# Altium schematic sheet INTERNAL_REGULATORS.SchDoc
size C; SheetNumber: 5; SheetTotal: 5
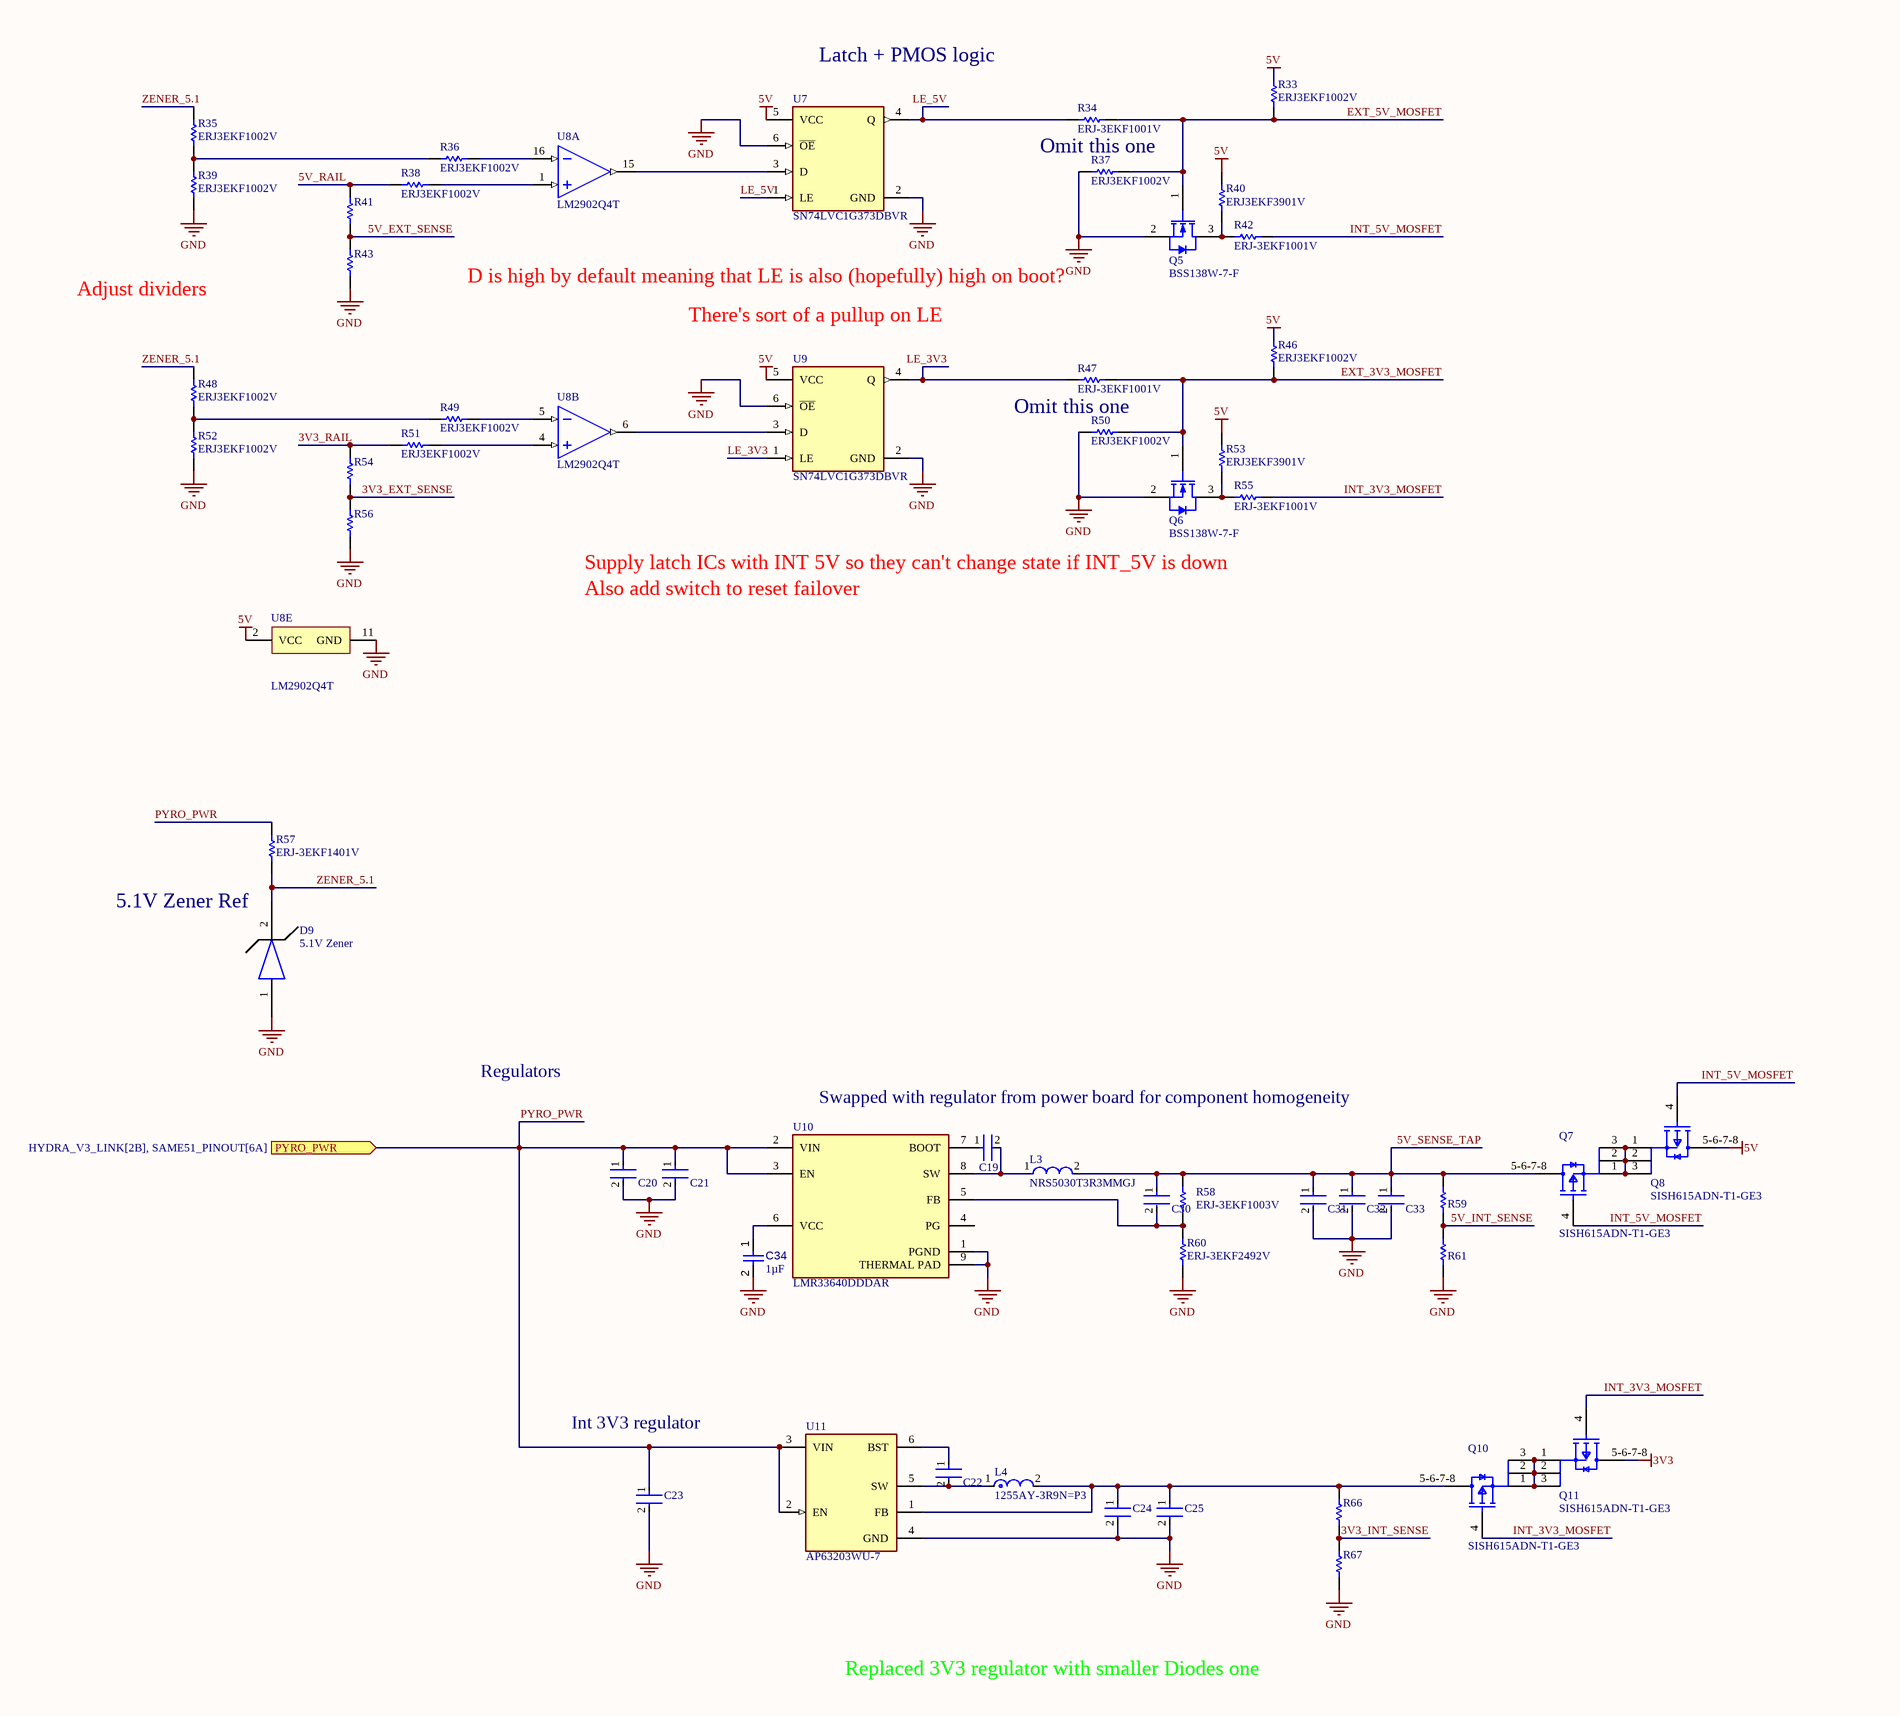
[diagram p0: INTERNAL_REGULATORS.SchDoc, left]
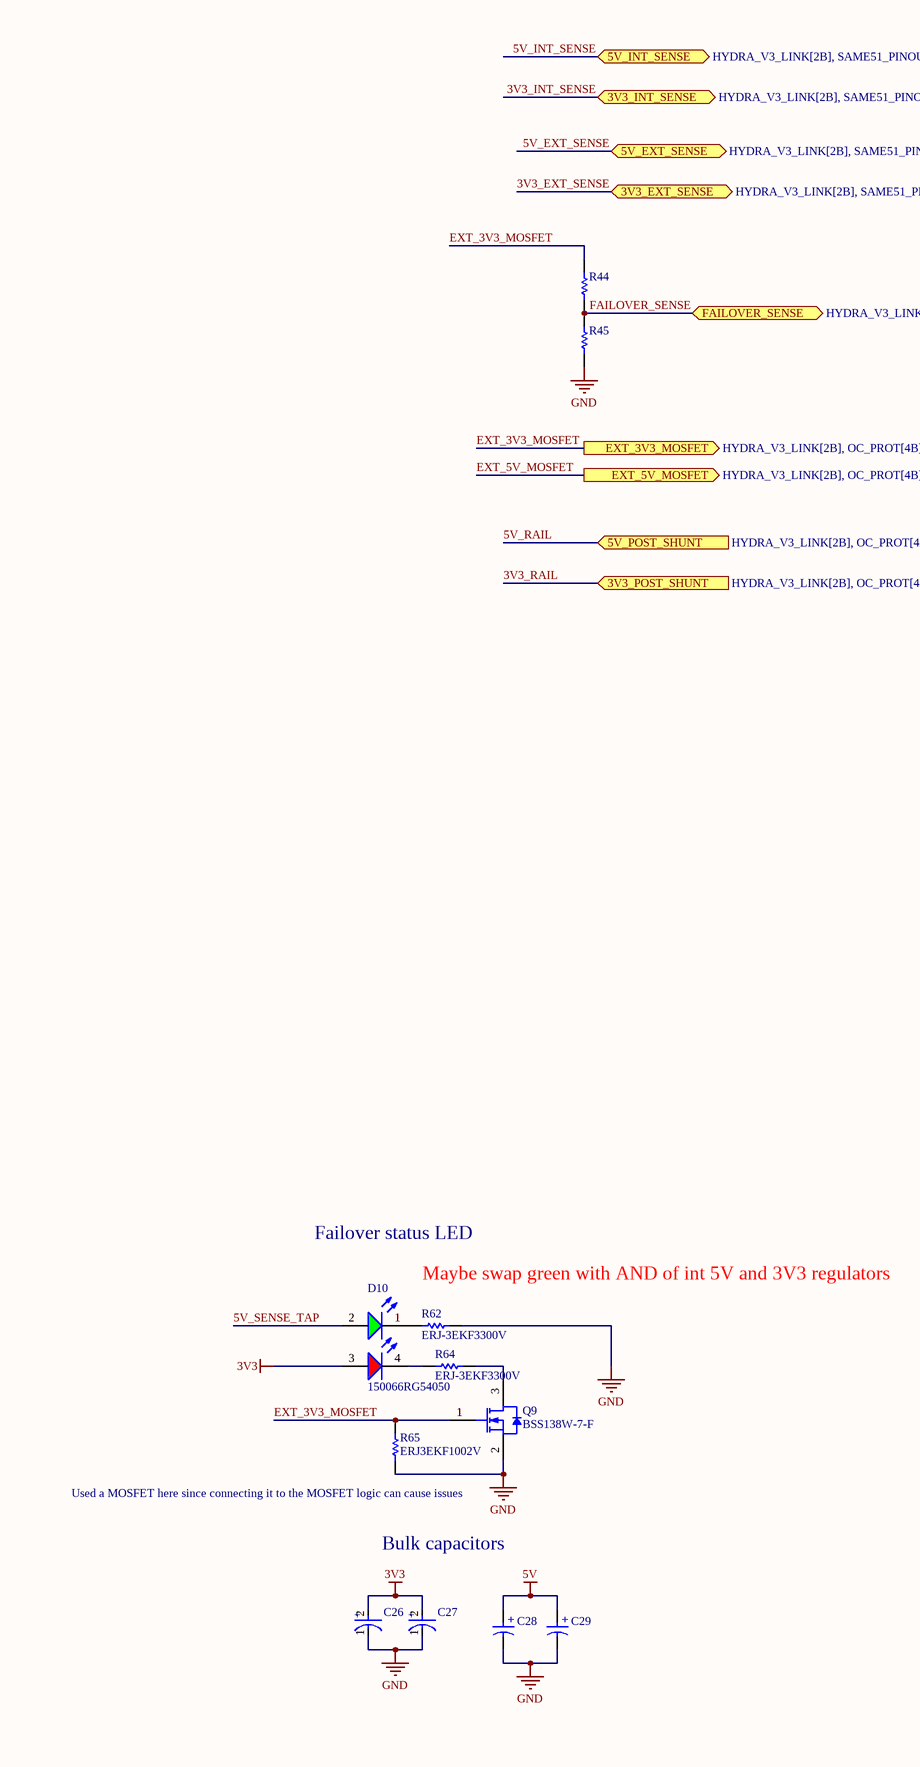
[diagram p1: INTERNAL_REGULATORS.SchDoc, right]

## Parts
C19  C0402C104K8PACTU  [FP-C0402-BB-MFG]  (value not drawn)
C20  CL10A106MA8NRNC  [FP-CL10-IPC_B]  (value not drawn)
C21  C0603C224M3RACTU  [FP-C0603C-CF-IPC_B]  (value not drawn)
C22  C0402C104K8PACTU  [FP-C0402-BB-MFG]  (value not drawn)
C23  C0805C106K8PACTU  [FP-C0805C-DG-MFG]  (value not drawn)
C24  GRM21BR61E226ME44L  [FP-GRM21B-0_2-e0_2_0_7-IPC_B]  (value not drawn)
C25  GRM21BR61E226ME44L  [FP-GRM21B-0_2-e0_2_0_7-IPC_B]  (value not drawn)
C26  6TPE120MAZB  [FP-POSCAP-B2-MFG]  (value not drawn)
C27  6TPE120MAZB  [FP-POSCAP-B2-MFG]  (value not drawn)
C28  875035119002  [WCAP-PHLE_L7.3W4.3H1.9]  (value not drawn)
C29  875035119002  [WCAP-PHLE_L7.3W4.3H1.9]  (value not drawn)
C30  C0603C101M3RACAUTO  [FP-C0603C-CF-IPC_B]  (value not drawn)
C31  CL10A226MO7JZNC  [FP-CL10-IPC_B]  (value not drawn)
C32  CL10A226MO7JZNC  [FP-CL10-IPC_B]  (value not drawn)
C33  CL10A226MO7JZNC  [FP-CL10-IPC_B]  (value not drawn)
C34  value 1µF  [CAPC1608X90X35ML15T15]  (hidden comment: Capacitor 1uF +/- 10% 16V 0603)
D9  5.1V Zener  [BZX884B5V1L-HG3-08-Footprint-1]
D10  150066RG54050  [WL-SBCD_0606]
L3  NRS5030T3R3MMGJ  [FP-NRS5030-H_3_1-MFG]
L4  1255AY-3R9N=P3  [FP-DG6045C-MFG]
Q5  BSS138W-7-F  [DIOD-SOT323-3_V]
Q6  BSS138W-7-F  [DIOD-SOT323-3_V]
Q7  SISH615ADN-T1-GE3  [SISH615ADN-T1-GE3-Footprint-1]
Q8  SISH615ADN-T1-GE3  [SISH615ADN-T1-GE3-Footprint-1]
Q9  BSS138W-7-F  [DIOD-SOT323-3_V]
Q10  SISH615ADN-T1-GE3  [SISH615ADN-T1-GE3-Footprint-1]
Q11  SISH615ADN-T1-GE3  [SISH615ADN-T1-GE3-Footprint-1]
R33  ERJ3EKF1002V  [RESC1609X55X30LL15T15]
R34  ERJ-3EKF1001V  [RESC1608X55X30LL15T15]
R35  ERJ3EKF1002V  [RESC1609X55X30LL15T15]
R36  ERJ3EKF1002V  [RESC1609X55X30LL15T15]
R37  ERJ3EKF1002V  [RESC1609X55X30LL15T15]
R38  ERJ3EKF1002V  [RESC1609X55X30LL15T15]
R39  ERJ3EKF1002V  [RESC1609X55X30LL15T15]
R40  ERJ3EKF3901V  [RESC1608X55X30ML15T15]
R41  ERJ3EKF1002V  [RESC1609X55X30LL15T15]  (value not drawn)
R42  ERJ-3EKF1001V  [RESC1608X55X30LL15T15]
R43  ERJ3EKF1002V  [RESC1609X55X30LL15T15]  (value not drawn)
R44  ERJ3EKF1002V  [RESC1609X55X30LL15T15]  (value not drawn)
R45  ERJ3EKF1002V  [RESC1609X55X30LL15T15]  (value not drawn)
R46  ERJ3EKF1002V  [RESC1609X55X30LL15T15]
R47  ERJ-3EKF1001V  [RESC1608X55X30LL15T15]
R48  ERJ3EKF1002V  [RESC1609X55X30LL15T15]
R49  ERJ3EKF1002V  [RESC1609X55X30LL15T15]
R50  ERJ3EKF1002V  [RESC1609X55X30LL15T15]
R51  ERJ3EKF1002V  [RESC1609X55X30LL15T15]
R52  ERJ3EKF1002V  [RESC1609X55X30LL15T15]
R53  ERJ3EKF3901V  [RESC1608X55X30ML15T15]
R54  ERJ3EKF1002V  [RESC1609X55X30LL15T15]  (value not drawn)
R55  ERJ-3EKF1001V  [RESC1608X55X30LL15T15]
R56  ERJ3EKF1002V  [RESC1609X55X30LL15T15]  (value not drawn)
R57  ERJ-3EKF1401V  [RESC1608X55X30NL15T15]
R58  ERJ-3EKF1003V  [RESC1608X55X30LL15T15]
R59  ERJ3EKF1002V  [RESC1609X55X30LL15T15]  (value not drawn)
R60  ERJ-3EKF2492V  [RESC1608X55X30LL15T15]
R61  ERJ3EKF1002V  [RESC1609X55X30LL15T15]  (value not drawn)
R62  ERJ-3EKF3300V  [RESC1608X55X30LL15T15]
R64  ERJ-3EKF3300V  [RESC1608X55X30LL15T15]
R65  ERJ3EKF1002V  [RESC1609X55X30LL15T15]
R66  ERJ3EKF1002V  [RESC1609X55X30LL15T15]  (value not drawn)
R67  ERJ3EKF1002V  [RESC1609X55X30LL15T15]  (value not drawn)
U7  SN74LVC1G373DBVR  [FP-DBV0006A-MFG]
U8  LM2902Q4T  [LM2902Q4T-Footprint-1]  (parts A,B,E of 5)
U9  SN74LVC1G373DBVR  [FP-DBV0006A-MFG]
U10  LMR33640DDDAR  [FP-DDA0008J-IPC_A]
U11  AP63203WU-7  [FP-TSOT26-MFG]

## Ports
3V3_EXT_SENSE (bidir, see HYDRA_V3_LINK[2B], SAME51_PINOUT[6B]), 3V3_INT_SENSE (bidir, see HYDRA_V3_LINK[2B], SAME51_PINOUT[6B]), 3V3_POST_SHUNT (in, see HYDRA_V3_LINK[2B], OC_PROT[4A]), 5V_EXT_SENSE (bidir, see HYDRA_V3_LINK[2B], SAME51_PINOUT[6B]), 5V_INT_SENSE (bidir, see HYDRA_V3_LINK[2B], SAME51_PINOUT[6A]), 5V_POST_SHUNT (in, see HYDRA_V3_LINK[2B], OC_PROT[4A]), EXT_3V3_MOSFET (out, see HYDRA_V3_LINK[2B], OC_PROT[4B]), EXT_5V_MOSFET (out, see HYDRA_V3_LINK[2B], OC_PROT[4B]), FAILOVER_SENSE (bidir, see HYDRA_V3_LINK[2B], SAME51_PINOUT[6B]), PYRO_PWR (in, see HYDRA_V3_LINK[2B], SAME51_PINOUT[6A])

## Nets
3V3: C26.2(A) C27.2(A) D10.3(A) Q11.5-6-7-8(D)
5V: C28.1(P) C29.1(P) Q8.5-6-7-8(D) R33.1 R40.2 R46.1 R53.2 U7.5(VCC) U8.2(VCC) U9.5(VCC)
GND: C20.2 C21.2 C23.2 C24.2 C25.2 C26.1(C) C27.1(C) C28.2(N) C29.2(N) C31.2 C32.2 C33.2 C34.2 D9.1 Q5.2(S) Q6.2(S) Q9.2(S) R37.2 R39.2 R43.1 R45.1 R50.2 R52.2 R56.1 R60.1 R61.1 R62.2 R65.1 R67.1 U7.2(GND) U7.6(~{OE}) U8.11(GND) U9.2(GND) U9.6(~{OE}) U10.1(PGND) U10.9(THERMAL_PAD) U11.4(GND)
3V3_EXT_SENSE: R54.1 R56.2 ; port 3V3_EXT_SENSE
3V3_INT_SENSE: R66.1 R67.2 ; port 3V3_INT_SENSE
3V3_RAIL: R51.2 R54.2 ; port 3V3_POST_SHUNT
5V_EXT_SENSE: R41.1 R43.2 ; port 5V_EXT_SENSE
5V_INT_SENSE: R59.1 R61.2 ; port 5V_INT_SENSE
5V_RAIL: R38.2 R41.2 ; port 5V_POST_SHUNT
5V_SENSE_TAP: C30.1 C31.1 C32.1 C33.1 D10.2(A) L3.2 Q7.5-6-7-8(D) R58.2 R59.2
EXT_3V3_MOSFET: Q6.1(G) Q9.1(G) R44.2 R46.2 R47.1 R50.1 R65.2 ; port EXT_3V3_MOSFET
EXT_5V_MOSFET: Q5.1(G) R33.2 R34.1 R37.1 ; port EXT_5V_MOSFET
FAILOVER_SENSE: R44.1 R45.2 ; port FAILOVER_SENSE
INT_3V3_MOSFET: Q10.4(G) Q11.4(G) R55.2
INT_5V_MOSFET: Q7.4(G) Q8.4(G) R42.2
LE_3V3: R47.2 U9.1(LE) U9.4(Q)
LE_5V: R34.2 U7.1(LE) U7.4(Q)
PYRO_PWR: C20.1 C21.1 C23.1 R57.2 U10.2(VIN) U10.3(EN) U11.2(EN) U11.3(VIN) ; port PYRO_PWR
ZENER_5.1: D9.2 R35.1 R48.1 R57.1
NetC19_1: C19.1 U10.7(BOOT)
NetC19_2: C19.2 L3.1 U10.8(SW)
NetC22_1: C22.1 U11.6(BST)
NetC22_2: C22.2 L4.1 U11.5(SW)
NetC24_1: C24.1 C25.1 L4.2 Q10.5-6-7-8(D) R66.2 U11.1(FB)
NetC30_2: C30.2 R58.1 R60.2 U10.5(FB)
NetC34_1: C34.1 U10.6(VCC)
NetD10_1: D10.1(K) R62.1
NetD10_4: D10.4(K) R64.1
NetQ5_3: Q5.3(D) R40.1 R42.1
NetQ6_3: Q6.3(D) R53.1 R55.1
NetQ7_1: Q7.1(S) Q7.2(S) Q7.3(S) Q8.1(S) Q8.2(S) Q8.3(S)
NetQ9_3: Q9.3(D) R64.2
NetQ10_1: Q10.1(S) Q10.2(S) Q10.3(S) Q11.1(S) Q11.2(S) Q11.3(S)
NetR35_2: R35.2 R36.2 R39.1
NetR36_1: R36.1 U8.16(1IN-)
NetR38_1: R38.1 U8.1(1IN+)
NetR48_2: R48.2 R49.2 R52.1
NetR49_1: R49.1 U8.5(2IN-)
NetR51_1: R51.1 U8.4(2IN+)
NetU7_3: U7.3(D) U8.15(1OUT)
NetU8_6: U8.6(2OUT) U9.3(D)

Not connected (* = marked no-connect by the designer): U10 4(PG)

## Notes on the sheet
- Latch + PMOS logic
- Omit this one
- Adjust dividers
- D is high by default meaning that LE is also (hopefully) high on boot?
- There's sort of a pullup on LE
- Supply latch ICs with INT 5V so they can't change state if INT_5V is down
- Also add switch to reset failover
- 5.1V Zener Ref
- Regulators
- Swapped with regulator from power board for component homogeneity
- Failover status LED
- Maybe swap green with AND of int 5V and 3V3 regulators
- Int 3V3 regulator
- (near R65) Used a MOSFET here since connecting it to the MOSFET logic can cause issues
- Bulk capacitors
- Replaced 3V3 regulator with smaller Diodes one
- (in symbol CMP-03913-98099420-1) +
- (in symbol CMP-05428-000212-1) +

## Library data of the parts
C19 C22 = CMP-2008-02046-2: CAP CER 0.1UF 10V X5R 0402; Manufacturer: Kemet; Material: Ceramic; Capacitance: 0.10 μF; Temperature Coefficient: 15%; Tolerance: 0.1; Value: 0.10 μF; Package: C0402-BB; Temperature: -55°C to +125°C; ComponentLink2Description: Datasheet; Temperature Characteristic: X5R; Device Class L1: Passive Components; Height: 0.55mm; Lead Free: Yes; ComponentLink2URL: https://content.kemet.com/datasheets/KEM_C1002_X7R_SMD.pdf; Device Class L2: Capacitors; Temperature Range Low: -55°C; Temperature Range High: +125°C; RoHS: TRUE; Octopart: https://octopart.com/c0402c104k8pactu-kemet-140039; Automotive: No; Mouser Description: Capacitor 100 nF 10 VDC 0402; Category: Cap; Voltage Rating: 10 V; Digikey Description: CAP CER 0.1UF 10V X5R 0402; Ipc Land Pattern Name: CAPC10050X50; Device Class L3: Ceramic Capacitors; Manufacturer Part Number: C0402C104K8PACTU
C20 = CMP-001-00091-1: Ceramic Capacitor, Multilayer, Ceramic, 25V, 20% +Tol, 20% -Tol, X5R, 15% TC, 10uF, Surface Mount, 0603
C21 = CMP-001-00092-1: Ceramic Capacitor, Multilayer, Ceramic, 25V, 20% +Tol, 20% -Tol, X7R, 15% TC, 0.22uF, Surface Mount, 0603
C23 = CMP-2007-03243-2: CAP CER 10UF 10V X5R 0805; Manufacturer: Kemet; 3DS Part Number: 220-00001; Tolerance: 10%; Temperature Coefficient: 15%; Material: Ceramic; Device Class L2: Capacitors; Device Class L1: Passive Components; ComponentLink2URL: https://content.kemet.com/datasheets/KEM_C1006_X5R_SMD.pdf; Height: 1.4mm; Lead Free: Yes; Manufacturer Part Number: C0805C106K8PACTU; Digikey Description: CAP CER 10UF 10V X5R 0805; Octopart: https://octopart.com/c0805c106k8pactu-kemet-98697; Capacitance: 10uF; Value: 10uF; Temperature Range Low: -55°C; Temperature: -55°C to +85°C; Automotive: No; Mouser Description: CAP CER 10UF 10V X5R 0805; Ipc Land Pattern Name: CAPC200125X125; Temperature Range High: +85°C; Voltage: 10V; RoHS: TRUE; Device Class L3: Ceramic Capacitors; ComponentLink2Description: Datasheet; Voltage Rating: 10V; Package: C0805C-DG; Temperature Characteristic: X5R; Category: Cap
C24 C25 = CMP-2007-03222-3: Chip Multilayer Ceramic Capacitors for General Purpose, 0805, 22uF, X5R, 15%, 20%, 25V; Case/Package: 0805; Depth: 1.25mm; Resistor Type: Ceramic; Voltage Rating: 25V; Lead Free: Lead Free; Voltage Rating (DC): 25V; Case Code (Metric): 2012; Thickness: 0.057inch; REACH SVHC: No SVHC; Material: Ceramic; Tolerance: 20%; Length: 2mm; Capacitance: 22uF; Case Code (Imperial): 0805; Max Operating Temperature: 85°C; Termination: SMD/SMT; Weight: 0.000335oz; Dielectric: X5R; Packaging: Tape and Reel; Voltage: 25V; Package Quantity: 3000; Height: 1.25mm; Mount: Surface Mount; Width: 1.25mm; Min Operating Temperature: -55°C
C26 C27 = CMP-05428-000212-1: Molded Tantalum Polymer Capacitor 120uF 20% 6.3V life 1000Hours SMD 1411; Ripple Current: 1.4A; Leakage Current: 75.6uA; ESR (Equivalent Series Resistance): 35mR; Dissipation Factor: 8%; Polarity: Polar; Features: General Purpose; Voltage Rating (DC): 6.3V; Depth: 2.8mm; Number of Pins: 2; Termination: SMD/SMT; Series: POSCAP™ TPE; Tolerance: 20%; Case Code (Imperial): 1210; RoHS Compliant: Yes; Height - Seated (Max): 0.079inch; Capacitance: 120uF; REACH SVHC: No SVHC; Packaging: Tape and Reel; Package Quantity: 2000; Voltage Rating: 6.3V; Construction: Flat; Voltage: 6.3V; Case/Package: Molded; Radiation Hardening: No; Width: 2.8mm; Case Code (Metric): 3528; Max Operating Temperature: 105°C; Min Operating Temperature: -55°C; Lead Free: Lead Free; Height: 1.9mm; Mount: Surface Mount; Length: 3.5mm
C28 C29 = CMP-03913-98099420-1: 875035119002 WCAP-PHLE Aluminum Polymer Capacitors; ESR (Equivalent Series Resistance): 9mΩ; Ripple Current: 6.3A; Voltage Rating (DC): 6.3V; Capacitance: 180µF; Leakage Current: 113.4µA; Height: 1.9mm; RoHS: Compliant; Width: 4.3mm; NexarPartId: 98099420; Max Operating Temperature: 105°C; Length: 7.3mm; Min Operating Temperature: -55°C; Voltage Rating: 6.3V
C30 = CMP-001-00093-1: Ceramic Capacitor, Ceramic, 25V, 20% +Tol, 20% -Tol, X7R, 15% TC, 0.0001uF, Surface Mount, 0603
C31-C33 = CMP-001-00090-1: Ceramic Capacitor, Multilayer, Ceramic, 16V, 20% +Tol, 20% -Tol, X5R, 15% TC, 22uF, Surface Mount, 0603
C34 = CMP-001-00004-6: Chip Capacitor, 1 uF, +/- 10%, 16 V, 0603 (1608 Metric); Capacitor Type: Ceramic; Mounting Technology: SM; RoHS Compliant: True; Min Operating Temperature: -55°C; Case/Package: 0603; Pins: 2; Voltage Rating: 16V; Max Operating Temperature: 125°C; Tolerance: 10%
D9 = CMP-004-00040-1: Diode Zener Single 5.1V 2% 300mW 2-Pin DFN1006 T/R
D10 = CMP-004-00034-2: Led, Red/Grn, 180Mcd/230Mcd, 624Nm/525Nm Rohs Compliant: Yes
L3 = CMP-14484-001052-1: Inductor Power Shielded Wirewound 3.3uH 20% 100KHz Ferrite 3A 39mΩ DCR T/R; Max DC Current: 3.6A; Self Resonant Frequency: 36MHz; DC Resistance (DCR): 30mR; Core Material: Ferrite; Current Rating: 3A; Case/Package: 5030; Depth: 4.9mm; Height - Seated (Max): 0.122inch; Inductance: 3.3uH; Saturation Current: 3.6A; Test Frequency: 100kHz; Length: 4.9mm; Mount: Surface Mount; Shielding: Shielded; Packaging: Tape and Reel; Min Operating Temperature: -25°C; Package Quantity: 1; Width: 0.193inch; Termination: SMD/SMT; RoHS Compliant: Yes; Tolerance: 20%; Halogen Free: Halogen Free; Radiation Hardening: No; Max Operating Temperature: 125°C; Height: 3mm
L4 = CMP-06042-002684-1: Shielded Wirewound Inductor 3.9uH 30% 4200mA 0.0264Ω SMD; Saturation Current: 4.7A; Test Frequency: 100kHz; Core Material: Ferrite; Current Rating: 4.2A; DC Resistance (DCR): 26.4mR; Inductance: 3.9uH; Resistor Type: Wirewound; Width: 0.248inch; Mount: Surface Mount; Tolerance: 30%; Packaging: Tape and Reel; Max Operating Temperature: 85°C; Shielding: Shielded; Length: 0.248inch; Min Operating Temperature: -40°C; Height - Seated (Max): 0.177inch; Case/Package: Nonstandard
Q5 Q6 Q9 = CMP-2000-05968-1: N-Channel Enhancement Mode Mosfet, 50 V, 200 mA, -55 to 150 degC, 6-Pin SOT-323, RoHS, Tape and Reel; Typical Turn-Off Delay Time: 20ns; Number of Channels: 1Channel; Type: EnhancementModeFieldEffectTransistor; Brand: DiodesIncorporated; Vds - Drain-Source Breakdown Voltage: 75V; Vgs - Gate-Source Voltage: 20V; Rds On - Drain-Source Resistance: 1.4Ohms; Transistor Type: 1N-Channel; Configuration: Single; Unit Weight: 0.000212oz; Pd - Power Dissipation: 200mW; Id - Continuous Drain Current: 200mA; Forward Transconductance - Min: 0.1S; Manufacturer URL: http://www.diodes.com/; Series: BSS138; Package Description: 3-Pin Small Outline Transistor, Body 2 x 1.25 mm, Pitch 0.65 mm; Mounting Technology: SurfaceMount; Product Category: MOSFET; RoHS: True; Maximum Operating Temperature: +150C; Height: 1mm; Length: 2.2mm; Technology: Si; Width: 1.35mm; Datasheet URL: http://www.diodes.com/_files/datasheets/ds30206.pdf; Manufacturer: DiodesIncorporated; Package / Case: SOT-323-3; Typical Turn-On Delay Time: 20ns; Transistor Polarity: N-Channel; Factory Pack Quantity: 3000; Packaging: Reel; Product: MOSFETSmallSignal; Datasheet Version: Rev. 11-2, 09/2013; Package Reference: SOT323; Minimum Operating Temperature: -55C; Mounting Style: SMD/SMT; Channel Mode: Enhancement
Q7 Q8 Q10 Q11 = CMP-013-00036-1: Trans MOSFET P-CH 20V 22.1A 8-Pin PowerPAK 1212 EP T/R
R33 R35-R39 R41 R43-R46 R48-R52 R54 R56 R59 R61 R65-R67 = CMP-1012-00623-3: Chip Resistor, 10 KOhm, +/- 1%, 0.1 W, -55 to 155 degC, 0603 (1608 Metric), RoHS, Tape and Reel; Manufacturer: Panasonic; Voltage Rating: 75V; Case\/Package: 0603; Power Rating: 100mW; Resistance: 10KOhm; Temperature Coefficient: 100ppm\/degreesC; Number of Pins: 2; Package Reference: 603; Depth: 0.8mm; Mount: SurfaceMount; Package Description: 2-Pin Surface Mount Device, Body 1.6 x 0.85 mm; Datasheet Version: 02/2017; Length: 1.6mm; Lead Free: LeadFree; Height: 0.45mm; Number of Terminations: 2; Max Power Dissipation: 100mW; Min Operating Temperature: -55degC; Datasheet URL: https://industrial.panasonic.com/cdbs/www-data/pdf/RDA0000/AOA0000C304.pdf; Termination: SMD/SMT; Case Code (Metric): 1608; Case Code (Imperial): 0603; Tolerance: 1%; Max Operating Temperature: 155degC; RoHSCompliant: true; Voltage Rating (DC): 75V; Radiation Hardening: No; Packaging: TapeandReel; Composition: ThickFilm; Mounting Technology: SurfaceMount; Manufacturer URL: http://www.panasonic.com/; Width: 0.031inch; REACH SVHC: NoSVHC; Contact Plating: Tin; Military Standard: Not; Package Quantity: 1
R34 R42 R47 R55 = CMP-2000-00180-1: Manufacturer: Panasonic; Part Number: ERJ-3EKF1001V
R40 R53 = CMP-2000-00475-1: Manufacturer: Panasonic; Part Number: ERJ3EKF3901V
R57 = CMP-2000-00246-1: Manufacturer: Panasonic; Part Number: ERJ-3EKF1401V
R58 = CMP-009-00188-1: Resistor Thick Film 0603 100K Ohm 1% 1/10W 100ppm/C Molded SMD Punched Carrier T/R
R60 = CMP-2000-00370-1: Manufacturer: Panasonic; Part Number: ERJ-3EKF2492V
R62 R64 = CMP-2000-00435-2: Chip Resistor, 330 Ohm, +/- 1%, 0.1 W, -55 to 155 degC, 0603 (1608 Metric), RoHS, Tape and Reel; Gender: Male; Mating Cycles: 10000; Current Rating: 500 mA; Voltage Rating: 10 V; REACH SVHC: No SVHC; PackageDescription: 2-Pin Surface Mount Device, Body 1.6 x 0.85 mm; Contact Finish: Gold; Pins: 8; ComponentLink1Description: Manufacturer URL; Packaging: Tape and Reel; Max Operating Temperature: 85 degC; Contact Material: Copper; Height: 1.45 mm; Width: 1.45 mm; DatasheetVersion: Apr-15; Package Quantity: 1500; Contact Plating: Gold; PackageReference: 0603; Mount: Surface Mount; Lead Pitch: 1.1 mm; Min Operating Temperature: -25 degC; ComponentLink1URL: http://www.panasonic.com/; ComponentLink2URL: http://industrial.panasonic.com/cdbs/www-data/pdf/RDA0000/AOA0000C86.pdf; Length: 13.7 mm; ComponentLink2Description: Datasheet; RoHSCompliant: true
U7 U9 = CMP-0859-00189-4: IC LTCH D-TYP SGL 3-OUT SOT-23-6; Manufacturer: Texas Instruments; Propagation Delay: 4.5ns; Number Of Circuits: 1; Max Supply Voltage: 5.5V; Standoff Height: 0mm; Nominal Supply Current: 10uA; Logic Function Desc: Non-Inverting; Max Junction Temp: +150°C; Frequency: 150MHz; Min Supply Voltage: 1.5V; Temperature Range High: +125°C; Octopart: https://octopart.com/sn74lvc1g373dbvr-texas+instruments-471164; RoHS: TRUE; Temperature: -40°C to +125°C; Temperature Range Low: -40°C; ComponentLink2URL: http://www.ti.com/lit/ds/symlink/sn74lvc1g373.pdf; Number Of Outputs: 1; Automotive: No; Package: DBV0006A; Device Class L3: Latches and Flip Flops; Device Class L2: Logic ICs; Manufacturer Part Number: SN74LVC1G373DBVR; Number Of Inputs: 1; Ambient Temperature Range High: +125°C; Category: IC; Ambient Temperature Range Low: -40°C; Digikey Description: IC LTCH D-TYP SGL 3-OUT SOT-23-6; Device Class L1: Integrated Circuits (ICs); Mouser Description: Latches Sngl D Type Latch; ComponentLink2Description: Datasheet; Height: 1.45mm; Lead Free: Yes
U8 = CMP-014-00004-1: LM2902 Series 30 V 1.3 MHz Low-Power Quad Operational Amplifier - QFN-16 (3x3)
U10 = CMP-019-00055-1: Switching Regulator, Current-mode, 4A, 1000kHz Switching Freq-Max, PDSO8
U11 = CMP-12757-000006-1: IC REG BUCK 3.3V 2A TSOT26; Manufacturer: Diodes Inc.; Output Type: Fixed; Min Supply Voltage: 3.8V; Number Of Outputs: 1; Max Junction Temp: +160°C; Nominal Supply Current: 22uA; Standoff Height: 0.01mm; Switching Frequency: 1.1MHz; Max Supply Voltage: 32V; ComponentLink2Description: Datasheet; Device Class L1: Integrated Circuits (ICs); Temperature: to +160°C; Device Class L3: Voltage Regulators - Switching; RoHS: TRUE; Octopart: https://octopart.com/ap63203wu-7-diodes+inc.-98099550; Output Voltage: 3.3V; Lead Free: Yes; ComponentLink2URL: https://www.diodes.com/assets/Datasheets/AP63200-AP63201-AP63203-AP63205.pdf; Digikey Description: IC REG BUCK 3.3V 2A TSOT26; Footprint Url: https://www.diodes.com/assets/Package-Files/TSOT26.pdf; Ambient Temperature Range High: +85°C; Height: 1mm; Automotive: No; Temperature Range High: +160°C; Switching Topology: Buck; Output Current: 2A; Package: TSOT26; Category: IC; Mouser Description: AP63203 Series 3.3 V 2 A SMT Fixed Low IQ Synchronous Buck - TSOT-26; Device Class L2: Power Management ICs; Ambient Temperature Range Low: -40°C; Manufacturer Part Number: AP63203WU-7